# Altium project BP_MotorDriver.PrjPcb
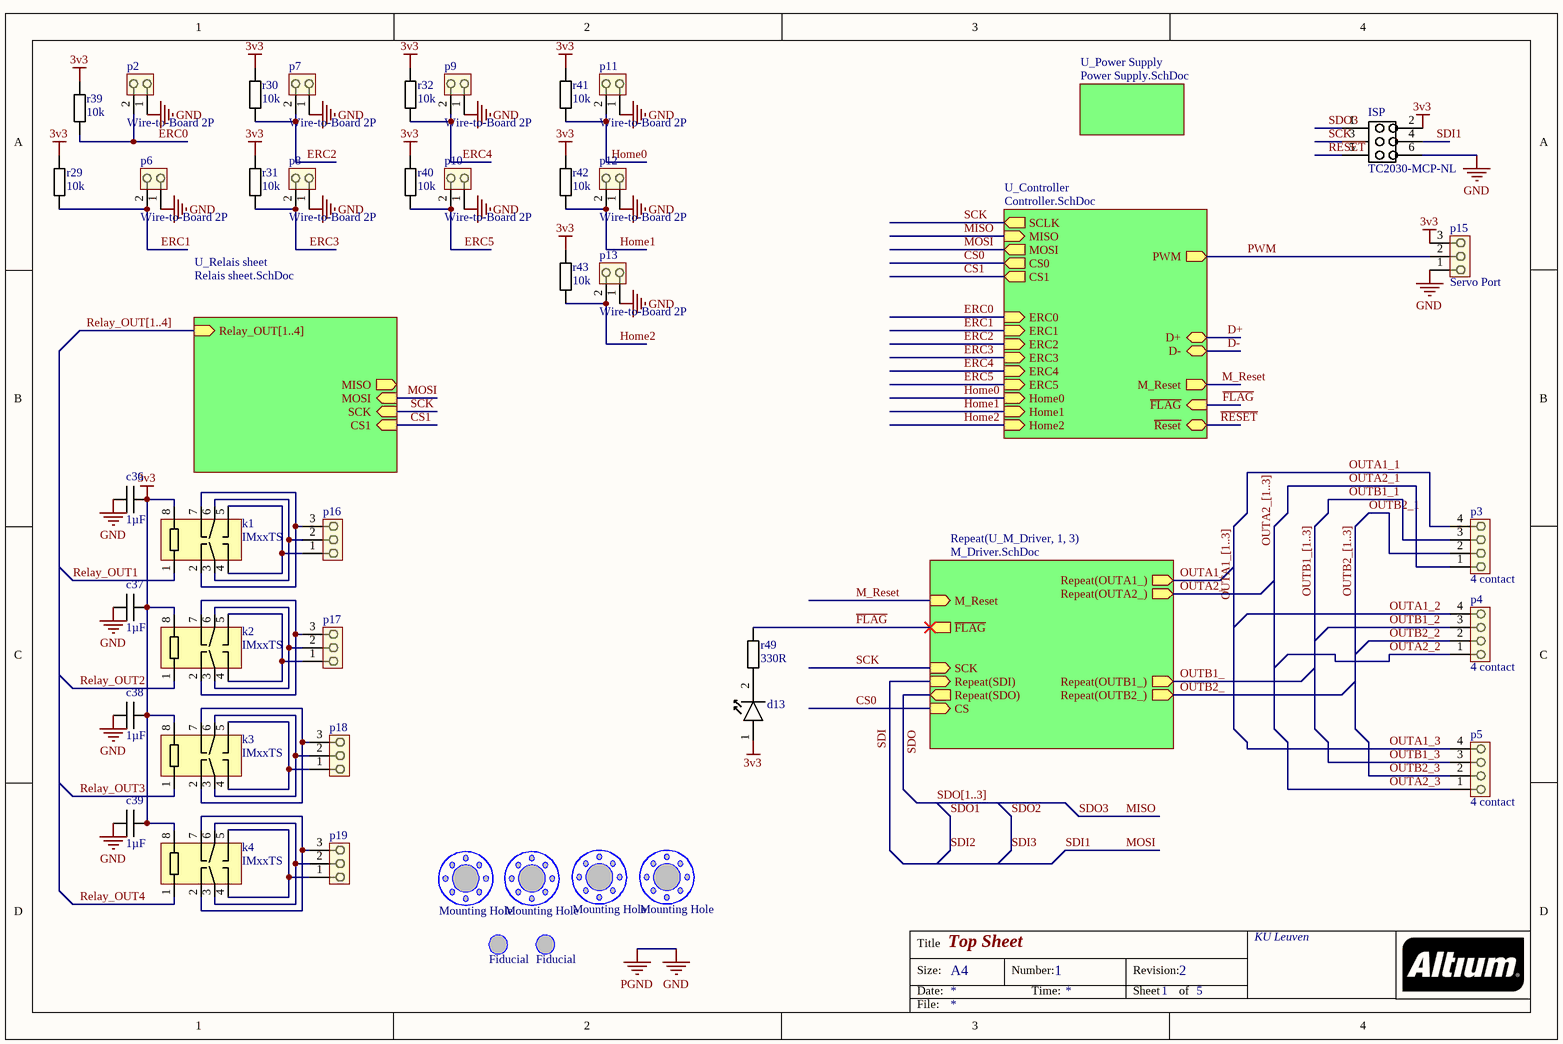
[diagram p0: TOP Sheet.SchDoc]
5 sheets, 213 parts. Net scope: hierarchical (ports join the sheet entries above them; power ports are global).
Board file: MotorDriverV2.PcbDoc
Sheets:
  TOP Sheet.SchDoc
    U_M_Driver1 = M_Driver.SchDoc
    U_M_Driver2 = M_Driver.SchDoc
    U_M_Driver3 = M_Driver.SchDoc
    U_Relais sheet = Relais sheet.SchDoc
    U_Controller = Controller.SchDoc
    U_Power Supply = Power Supply.SchDoc

## Sheet TOP Sheet.SchDoc: Top Sheet
size A4; Date: 14/02/2018; CheckedBy: Mr. Pauwels; Author: Robbie Smedts; DrawnBy: Robbie Smedts; Engineer: Robbie Smedts; Organization: KU Leuven; DocumentNumber: 1; Revision: 2; SheetNumber: 1; SheetTotal: 5; DocumentName: Top Sheet

### Parts
c36  1µF  [0805]
c37  1µF  [0805]
c38  1µF  [0805]
c39  1µF  [0805]
d13  Yellow SMD LED  [0603 - LED]  (value not drawn)
f3  Fiducial  [Fiducial]
f4  Fiducial  [Fiducial]
H1  Mounting Hole  [Mounting Hole]
H2  Mounting Hole  [Mounting Hole]
H3  Mounting Hole  [Mounting Hole]
H4  Mounting Hole  [Mounting Hole]
ISP  TC2030-MCP-NL  [2x3-HeaderPin]
k1  IMxxTS  [THT-8]
k2  IMxxTS  [THT-8]
k3  IMxxTS  [THT-8]
k4  IMxxTS  [THT-8]
p2  Wire-to-Board 2P  [WtB-F-2p_V]
p3  4 contact  [WtB-F-4p]
p4  4 contact  [WtB-F-4p]
p5  4 contact  [WtB-F-4p]
p6  Wire-to-Board 2P  [WtB-F-2p_V]
p7  Wire-to-Board 2P  [WtB-F-2p_V]
p8  Wire-to-Board 2P  [WtB-F-2p_V]
p9  Wire-to-Board 2P  [WtB-F-2p_V]
p10  Wire-to-Board 2P  [WtB-F-2p_V]
p11  Wire-to-Board 2P  [WtB-F-2p_V]
p12  Wire-to-Board 2P  [WtB-F-2p_V]
p13  Wire-to-Board 2P  [WtB-F-2p_V]
p15  Servo Port  [1X3 Headerpin Angled]
p16  Wire-to-Board 3P  [1X3 Headerpin Angled]  (value not drawn)
p17  Wire-to-Board 3P  [1X3 Headerpin Angled]  (value not drawn)
p18  Wire-to-Board 3P  [1X3 Headerpin Angled]  (value not drawn)
p19  Wire-to-Board 3P  [1X3 Headerpin Angled]  (value not drawn)
r29  10k  [0603]
r30  10k  [0603]
r31  10k  [0603]
r32  10k  [0603]
r39  10k  [0603]
r40  10k  [0603]
r41  10k  [0603]
r42  10k  [0603]
r43  10k  [0603]
r49  330R  [0603]

### Sub-sheets
Repeat(U_M_Driver, 1, 3) = M_Driver.SchDoc: Repeat(OUTA1_) (out), Repeat(OUTA2_) (out), Repeat(OUTB1_) (out), Repeat(OUTB2_) (out), Repeat(SDO) (out), Repeat(SDI) (in), SCK (in), CS (in), ~{FLAG} (out), M_Reset (in)
U_Controller = Controller.SchDoc: MOSI (out), MISO (in), SCLK (out), CS0 (out), CS1 (out), ERC0 (in), ERC1 (in), ERC2 (in), ERC3 (in), ERC4 (in), ERC5 (in), Home0 (in), Home1 (in), Home2 (in), ~{FLAG} (in), PWM (out), ~{Reset} (bidir), D+ (bidir), D- (bidir), M_Reset (out)
U_Power Supply = Power Supply.SchDoc: no entries
U_Relais sheet = Relais sheet.SchDoc: CS1 (in), MOSI (in), MISO (out), SCK (in), Relay_OUT[1..4] (in)

### Nets
3V3: c36.2 c37.2 c38.2 c39.2 d13.1(Anode) ISP.2 k1.8 k2.8 k3.8 k4.8 p15.3 r29.2 r30.2 r31.2 r32.2 r39.2 r40.2 r41.2 r42.2 r43.2
GND: c36.1 c37.1 c38.1 c39.1 ISP.6 p2.1 p6.1 p7.1 p8.1 p9.1 p10.1 p11.1 p12.1 p13.1 p15.1  [also labelled PGND]
CS0: sheet Repeat(U_M_Driver, 1, 3)/CS, sheet U_Controller/CS0
CS1: sheet U_Relais sheet/CS1, sheet U_Controller/CS1
D+: sheet U_Controller/D+
D-: sheet U_Controller/D-
ERC0: p2.2 r39.1 ; sheet U_Controller/ERC0
ERC1: p6.2 r29.1 ; sheet U_Controller/ERC1
ERC2: p7.2 r30.1 ; sheet U_Controller/ERC2
ERC3: p8.2 r31.1 ; sheet U_Controller/ERC3
ERC4: p9.2 r32.1 ; sheet U_Controller/ERC4
ERC5: p10.2 r40.1 ; sheet U_Controller/ERC5
~{FLAG}: r49.2 ; sheet Repeat(U_M_Driver, 1, 3)/~{FLAG}, sheet U_Controller/~{FLAG}
Home0: p11.2 r41.1 ; sheet U_Controller/Home0
Home1: p12.2 r42.1 ; sheet U_Controller/Home1
Home2: p13.2 r43.1 ; sheet U_Controller/Home2
M_Reset: sheet Repeat(U_M_Driver, 1, 3)/M_Reset, sheet U_Controller/M_Reset
MISO: ISP.1 ; sheet U_Controller/MISO  [also labelled SDO3]
MOSI: ISP.4 ; sheet U_Relais sheet/MOSI, sheet U_Controller/MOSI  [also labelled SDI1]
OUTA1_: sheet Repeat(U_M_Driver, 1, 3)/Repeat(OUTA1_)
OUTA1_1: p3.4  [project net OUTA1]
OUTA1_2: p4.4  [project net OUTA1]
OUTA1_3: p5.4  [project net OUTA1]
OUTA2_: sheet Repeat(U_M_Driver, 1, 3)/Repeat(OUTA2_)
OUTA2_1: p3.1  [project net OUTA2]
OUTA2_2: p4.1  [project net OUTA2]
OUTA2_3: p5.1  [project net OUTA2]
OUTB1_: sheet Repeat(U_M_Driver, 1, 3)/Repeat(OUTB1_)
OUTB1_1: p3.3  [project net OUTB1]
OUTB1_2: p4.3  [project net OUTB1]
OUTB1_3: p5.3  [project net OUTB1]
OUTB2_: sheet Repeat(U_M_Driver, 1, 3)/Repeat(OUTB2_)
OUTB2_1: p3.2  [project net OUTB2]
OUTB2_2: p4.2  [project net OUTB2]
OUTB2_3: p5.2  [project net OUTB2]
PWM: p15.2 ; sheet U_Controller/PWM
~{RESET}: ISP.5 ; sheet U_Controller/~{Reset}
Relay_OUT1: k1.1
Relay_OUT2: k2.1
Relay_OUT3: k3.1
Relay_OUT4: k4.1
SCK: ISP.3 ; sheet Repeat(U_M_Driver, 1, 3)/SCK, sheet U_Relais sheet/SCK, sheet U_Controller/SCLK
SDI: sheet Repeat(U_M_Driver, 1, 3)/Repeat(SDI)
SDO: sheet Repeat(U_M_Driver, 1, 3)/Repeat(SDO)
Netd13_2: d13.2(Kathode) r49.1
Netk1_2: k1.2 k1.7 p16.3
Netk1_3: k1.3 k1.6 p16.2
Netk1_4: k1.4 k1.5 p16.1
Netk2_2: k2.2 k2.7 p17.3
Netk2_3: k2.3 k2.6 p17.2
Netk2_4: k2.4 k2.5 p17.1
Netk3_2: k3.2 k3.7 p18.3
Netk3_3: k3.3 k3.6 p18.2
Netk3_4: k3.4 k3.5 p18.1
Netk4_2: k4.2 k4.7 p19.3
Netk4_3: k4.3 k4.6 p19.2
Netk4_4: k4.4 k4.5 p19.1

### Buses and harness runs
bus OUTA1_[1..3]
bus OUTA2_[1..3]
bus OUTB1_[1..3]
bus OUTB2_[1..3]
bus Relay_OUT[1..4] = sheet U_Relais sheet/Relay_OUT[1..4]
bus SDO[1..3]

### Notes on the sheet
- Title
- Size:
- Date:
- A4
- Number:
- Time:
- Revision:
- Sheet
- of
- File:

### Library data of the parts
c36-c39 = 0805 Capacitor: ...F
d13 = Yellow SMD LED: 0603 Package
ISP = 2x3 Header: Header Pin
k1-k4 = IMxxTS: Standard THT Package
p3-p5 = Wire-to-Board connector 4 contacts: Wire-to-Board connector
p15 = Wire-to-Board 3 Pin
r29-r32 r39-r43 r49 = 0603 Resistor: ...R

## Sheet M_Driver.SchDoc: M_Driver
size A4; Date: 12/02/2018; CheckedBy: Mr. Pauwels; Author: Robbie Smedts; CompanyName: KU Leuven; DrawnBy: Robbie Smedts; Engineer: Robbie Smedts & Vincent Agemans; Organization: KU Leuven; DocumentNumber: 4; Revision: 2; SheetNumber: 4; SheetTotal: 5; DocumentName: M_Driver
Used 3 times, as channels U_M_Driver1, U_M_Driver2, U_M_Driver3. Parts and nets are listed once, with the designators drawn on the sheet.
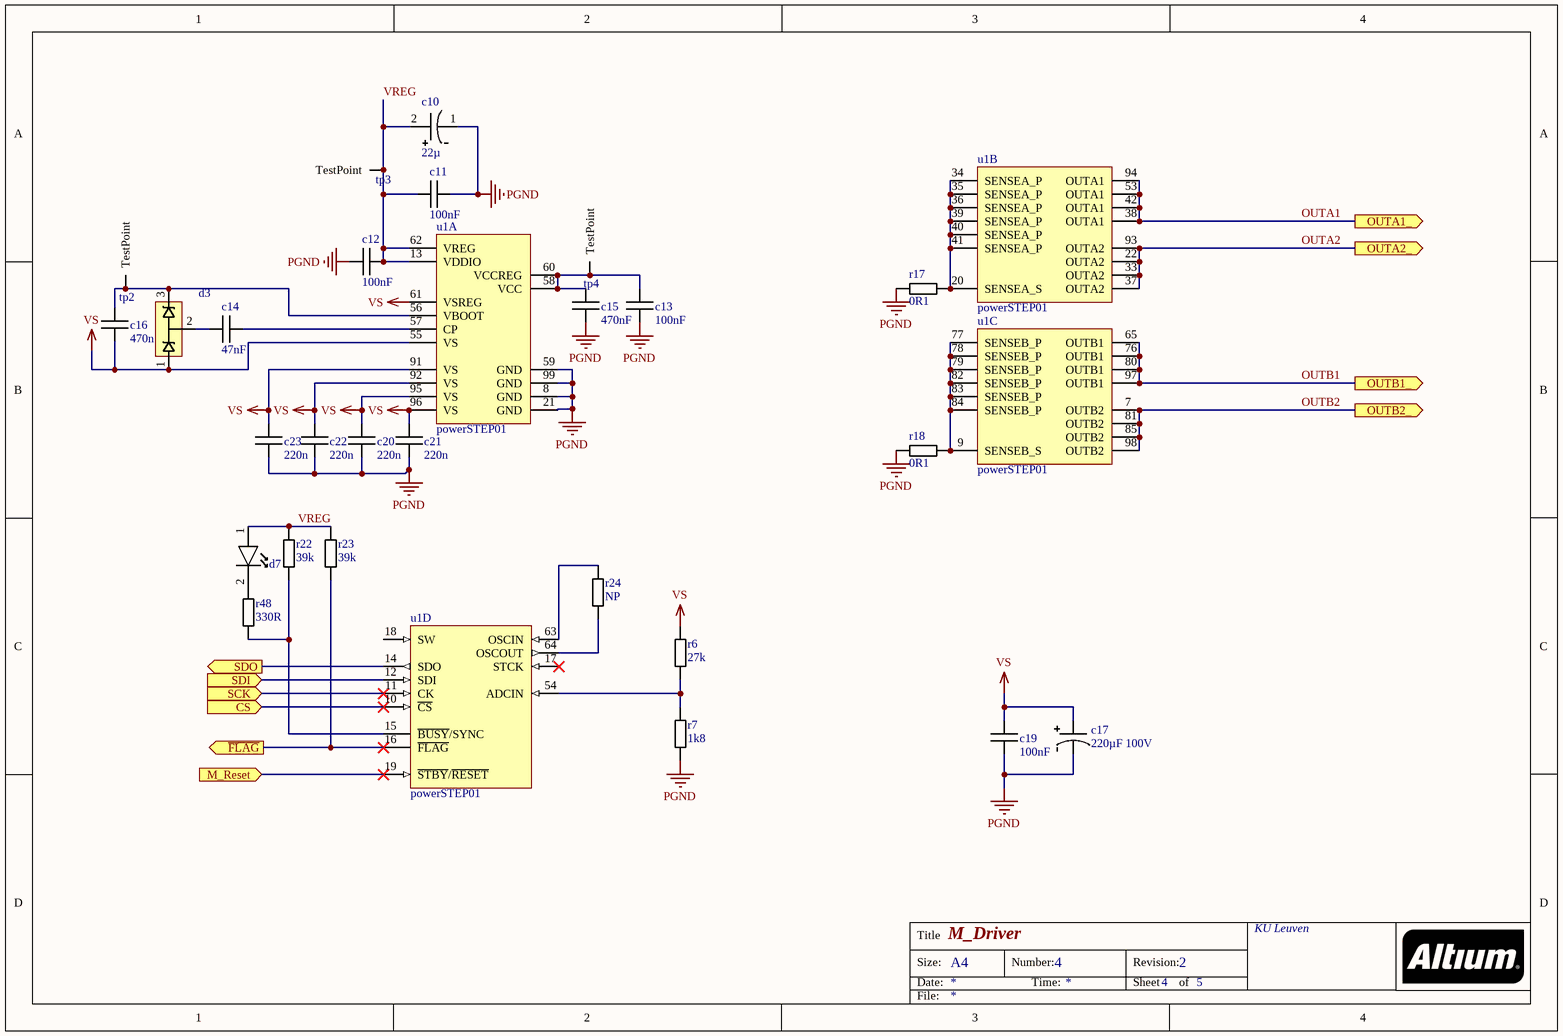
[diagram p1: M_Driver.SchDoc]

### Parts
c10  22µ  [Elco-B]
c11  100nF  [0805]
c12  100nF  [0805]
c13  100nF  [0805]
c14  47nF  [0805]
c15  470nF  [0805]
c16  470n  [0805]
c17  220µF 100V  [TH Elco 12.5]
c19  100nF  [0805]
c20  220n  [0805]
c21  220n  [0805]
c22  220n  [0805]
c23  220n  [0805]
d3  BAS40-04  [SOT23]  (value not drawn)
d7  Yellow SMD LED  [0603 - LED]  (value not drawn)
r6  27k  [0805]
r7  1k8  [0805]
r17  0R1  [2512]
r18  0R1  [2512]
r22  39k  [0805]
r23  39k  [0805]
r24  NP  [0603]
r48  330R  [0603]
tp2  Test Point  [Test Point]  (value not drawn)
tp3  Test Point  [Test Point]  (value not drawn)
tp4  Test Point  [Test Point]  (value not drawn)
u1  powerSTEP01  [VFQFPN]  (parts A,B,C,D of 4)

### Ports
CS (in), M_Reset (in), OUTA1_ (out), OUTA2_ (out), OUTB1_ (out), OUTB2_ (out), SCK (in), SDI (in), SDO (out), ~{FLAG} (out)

### Nets
PGND: c10.1 c11.1 c12.2 c13.1 c15.1 c17.1 c19.1 c20.2 c21.2 c22.2 c23.2 r7.1 r17.1 r18.1 u1.8(GND) u1.21(GND) u1.59(GND) u1.99(GND)
VS: c16.2 c17.2 c19.2 c20.1 c21.1 c22.1 c23.1 d3.1 r6.2 u1.55(VS) u1.61(VSREG) u1.91(VS) u1.92(VS) u1.95(VS) u1.96(VS)
CS: u1.10(~{CS}) ; port CS
~{FLAG}: r23.2 u1.16(~{FLAG}) ; port ~{FLAG}
M_Reset: u1.19(~{STBY}/~{RESET}) ; port M_Reset
OUTA1: u1.38(OUTA1) u1.42(OUTA1) u1.53(OUTA1) u1.94(OUTA1) ; port OUTA1_
OUTA2: u1.22(OUTA2) u1.33(OUTA2) u1.37(OUTA2) u1.93(OUTA2) ; port OUTA2_
OUTB1: u1.65(OUTB1) u1.76(OUTB1) u1.80(OUTB1) u1.97(OUTB1) ; port OUTB1_
OUTB2: u1.7(OUTB2) u1.81(OUTB2) u1.85(OUTB2) u1.98(OUTB2) ; port OUTB2_
SCK: u1.11(CK) ; port SCK
SDI: u1.12(SDI) ; port SDI
SDO: u1.14(SDO) ; port SDO
VREG: c10.2 c11.2 c12.1 d7.1(Anode) r22.1 r23.1 tp3.1(TestPoint) u1.13(VDDIO) u1.62(VREG)
Netc13_2: c13.2 c15.2 tp4.1(TestPoint) u1.58(VCC) u1.60(VCCREG)
Netc14_1: c14.1 d3.2
Netc14_2: c14.2 u1.57(CP)
Netc16_1: c16.1 d3.3 tp2.1(TestPoint) u1.56(VBOOT)
Netd7_2: d7.2(Kathode) r48.2
Netr6_1: r6.1 r7.2 u1.54(ADCIN)
Netr17_2: r17.2 u1.20(SENSEA_S) u1.34(SENSEA_P) u1.35(SENSEA_P) u1.36(SENSEA_P) u1.39(SENSEA_P) u1.40(SENSEA_P) u1.41(SENSEA_P)
Netr18_2: r18.2 u1.9(SENSEB_S) u1.77(SENSEB_P) u1.78(SENSEB_P) u1.79(SENSEB_P) u1.82(SENSEB_P) u1.83(SENSEB_P) u1.84(SENSEB_P)
Netr22_2: r22.2 r48.1 u1.15(~{BUSY}/SYNC)
Netr24_1: r24.1 u1.64(OSCOUT)
Netr24_2: r24.2 u1.63(OSCIN)

Not connected (* = marked no-connect by the designer): u1 17(STCK)* 18(SW)

### Channels
U_M_Driver1: designators end in _U_M_Driver1; ports CS=CS0 M_Reset=M_Reset OUTA1_=OUTA1 OUTA2_=OUTA2 OUTB1_=OUTB1 OUTB2_=OUTB2 SCK=SCK SDI=MOSI SDO=SDI2 ~{FLAG}=~{FLAG}
U_M_Driver2: designators end in _U_M_Driver2; ports CS=CS0 M_Reset=M_Reset OUTA1_=OUTA1 OUTA2_=OUTA2 OUTB1_=OUTB1 OUTB2_=OUTB2 SCK=SCK SDI=SDI2 SDO=SDI3 ~{FLAG}=~{FLAG}
U_M_Driver3: designators end in _U_M_Driver3; ports CS=CS0 M_Reset=M_Reset OUTA1_=OUTA1 OUTA2_=OUTA2 OUTB1_=OUTB1 OUTB2_=OUTB2 SCK=SCK SDI=SDI3 SDO=MISO ~{FLAG}=~{FLAG}

### Notes on the sheet
- Title
- Size:
- Date:
- A4
- Number:
- Time:
- Revision:
- Sheet
- of
- File:

### Library data of the parts
c10 = Elco B
c11-c16 c19-c23 = 0805 Capacitor: ...F
c17 = Elco TH d12.5: d = 12.5mm
d7 = Yellow SMD LED: 0603 Package
r6 r7 r22 r23 = 0805 Resistor: ...R
r17 r18 = 2512 Resistor: ..R
r24 r48 = 0603 Resistor: ...R
u1 = powerSTEP01: VFQFPN

## Sheet Relais sheet.SchDoc: Relay Sheet
size A4; Date: 15/02/2018; CheckedBy: Mr. Pauwels; Author: Robbie Smedts; CompanyName: KU Leuven; DrawnBy: Robbie Smedts; Engineer: Robbie Smedts & Vincent Agemans; Organization: Thomas More; DocumentNumber: 3; Revision: 2; SheetNumber: 3; SheetTotal: 5
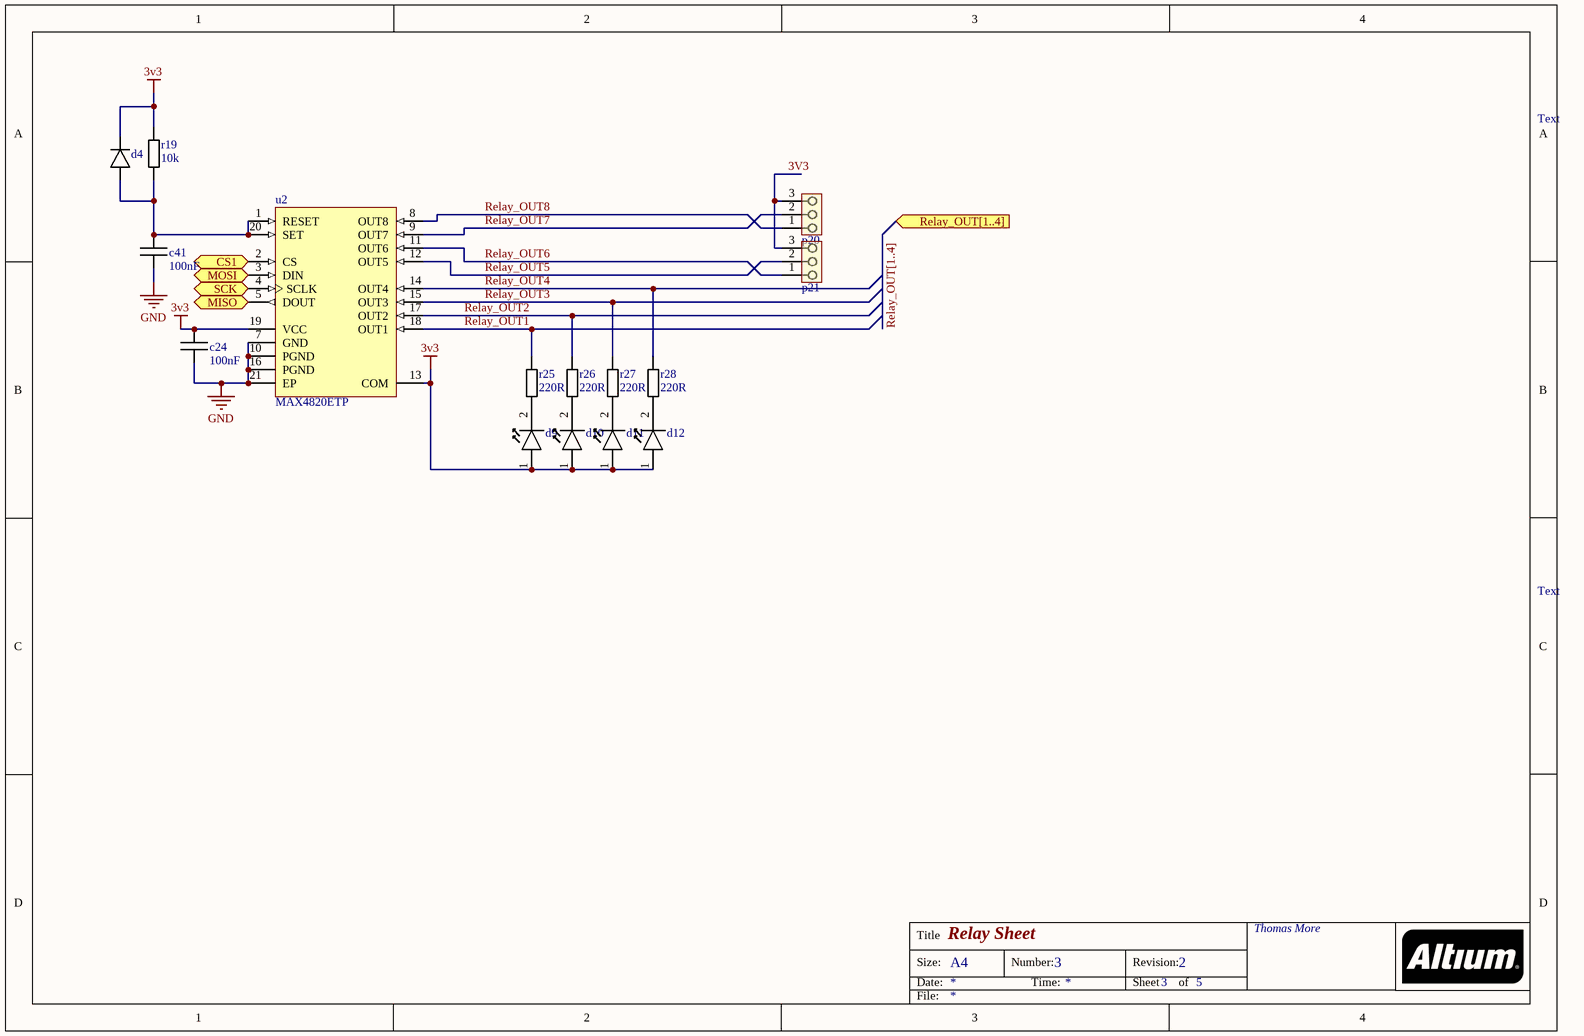
[diagram p2: Relais sheet.SchDoc]

### Parts
c24  100nF  [0805]
c41  100nF  [0603]
d4  CD1206-S01575  [1206 - DIODE]  (value not drawn)
d9  Yellow SMD LED  [0603 - LED]  (value not drawn)
d10  Yellow SMD LED  [0603 - LED]  (value not drawn)
d11  Yellow SMD LED  [0603 - LED]  (value not drawn)
d12  Yellow SMD LED  [0603 - LED]  (value not drawn)
p20  Wire-to-Board 3P  [1X3 Headerpin Angled]  (value not drawn)
p21  Wire-to-Board 3P  [1X3 Headerpin Angled]  (value not drawn)
r19  10k  [0603]
r25  220R  [0603]
r26  220R  [0603]
r27  220R  [0603]
r28  220R  [0603]
u2  MAX4820ETP  [TQFN-20]

### Ports
CS1 (in), MISO (out), MOSI (in), Relay_OUT[1..4] (in), SCK (in)

### Nets
3V3: c24.1 d4.1(Kathode) d9.1(Anode) d10.1(Anode) d11.1(Anode) d12.1(Anode) p20.3 p21.3 r19.2 u2.13(COM) u2.19(VCC)
GND: c24.2 c41.1 u2.0(EP) u2.7(GND) u2.10(PGND) u2.16(PGND) u2.21(EP)
CS1: u2.2(CS) ; port CS1
MOSI: u2.3(DIN) ; port MOSI
Relay_OUT1: r25.2 u2.18(OUT1)
Relay_OUT2: r26.2 u2.17(OUT2)
Relay_OUT3: r27.2 u2.15(OUT3)
Relay_OUT4: r28.2 u2.14(OUT4)
Relay_OUT5: p21.2 u2.12(OUT5)
Relay_OUT6: p21.1 u2.11(OUT6)
Relay_OUT7: p20.2 u2.9(OUT7)
Relay_OUT8: p20.1 u2.8(OUT8)
SCK: u2.4(SCLK) ; port SCK
Netc41_2: c41.2 d4.2(Anode) r19.1 u2.1(RESET) u2.20(SET)
Netd9_2: d9.2(Kathode) r25.1
Netd10_2: d10.2(Kathode) r26.1
Netd11_2: d11.2(Kathode) r27.1
Netd12_2: d12.2(Kathode) r28.1
Netu2_5: u2.5(DOUT) ; port MISO

### Buses and harness runs
bus Relay_OUT[1..4] = port Relay_OUT[1..4]

### Notes on the sheet
- Text
- Title
- Size:
- Date:
- A4
- Number:
- Time:
- Revision:
- Sheet
- of
- File:

### Library data of the parts
c24 = 0805 Capacitor: ...F
c41 = 0603 Capacitor: ...F
d4 = CD1206-S01575: Switching Chip Diode
d9-d12 = Yellow SMD LED: 0603 Package
r19 r25-r28 = 0603 Resistor: ...R
u2 = MAX4820ETP: 20 TQFN-EP

## Sheet Controller.SchDoc: Controller schematic
size A4; Date: 2018-02-12; CheckedBy: Mr. Pauwels; Author: Robbie Smedts; CompanyName: Thomas More; DrawnBy: Robbie Smedts; Engineer: Robbie Smedts & Vincent Agemans; Organization: KULeuven; DocumentNumber: 2; Revision: 2; SheetNumber: 2; SheetTotal: 5; DocumentName: Controller Schematic; ProjectName: Stepper driver
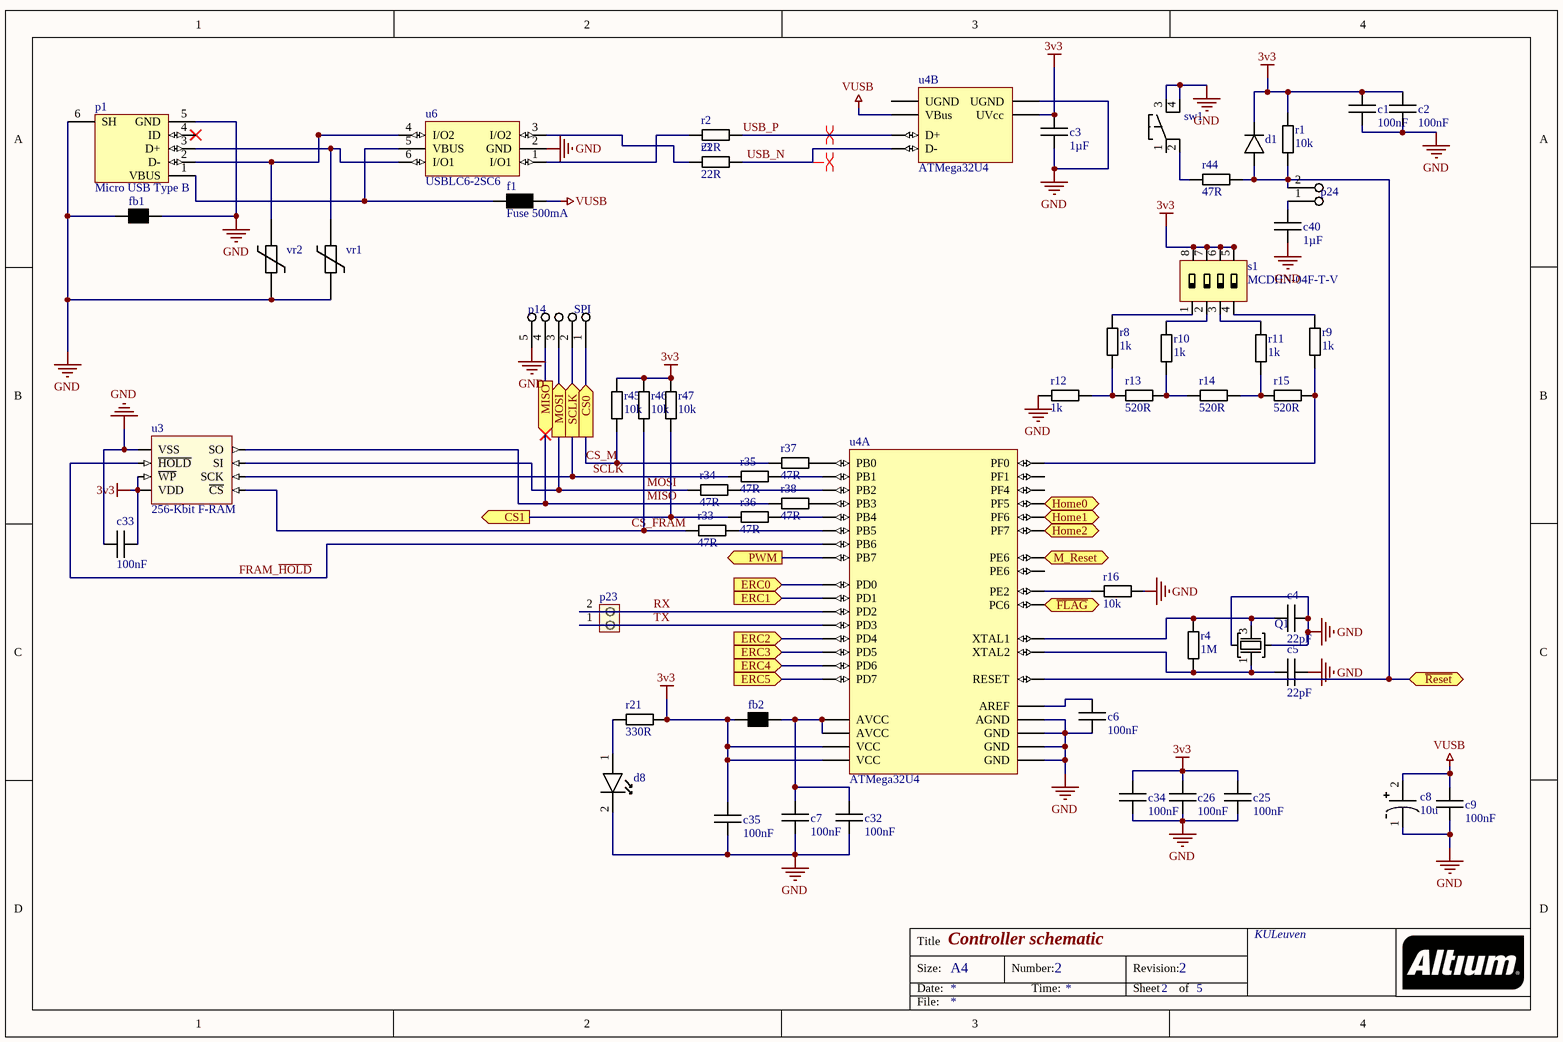
[diagram p3: Controller.SchDoc]

### Parts
c1  100nF  [0603]
c2  100nF  [0603]
c3  1µF  [0603]
c4  22pF  [0603]
c5  22pF  [0603]
c6  100nF  [0603]
c7  100nF  [0603]
c8  10u  [Elco-C]
c9  100nF  [0603]
c25  100nF  [0603]
c26  100nF  [0603]
c32  100nF  [0603]
c33  100nF  [0603]
c34  100nF  [0603]
c35  100nF  [0603]
c40  1µF  [0603]
d1  CD1206-S01575  [1206 - DIODE]  (value not drawn)
d8  Green SMD LED  [0603 - LED]  (value not drawn)
f1  Fuse 500mA  [PTC Fuses]
fb1  0603 Ferrite Bead  [0603]  (value not drawn)
fb2  0603 Ferrite Bead  [0603]  (value not drawn)
p1  Micro USB Type B  [Micro USB Type B]
p14  SPI  [1x5-HeaderPin]
p23  Wire-to-Board 2P  [WtB-F-2p]  (value not drawn)
p24  2 Pin Header  [1x2-HeaderPin]  (value not drawn)
Q1  Crystal 16MHz, 3.2x2.5mm  [X32]  (value not drawn)
r1  10k  [0603]
r2  22R  [0603]
r3  22R  [0603]
r4  1M  [0603]
r8  1k  [0603]
r9  1k  [0603]
r10  1k  [0603]
r11  1k  [0603]
r12  1k  [0603]
r13  520R  [0603]
r14  520R  [0603]
r15  520R  [0603]
r16  10k  [0603]
r21  330R  [0603]
r33  47R  [0603]
r34  47R  [0603]
r35  47R  [0603]
r36  47R  [0603]
r37  47R  [0603]
r38  47R  [0603]
r44  47R  [0603]
r45  10k  [0603]
r46  10k  [0603]
r47  10k  [0603]
s1  MCDHN-04F-T-V  [Dipswitch-4]
sw1  MCDTSJW-6  [MCDTSJW6]  (value not drawn)
u3  256-Kbit F-RAM  [SOIC8N]
u4  ATMega32U4  [TQFP-44]  (parts A,B of 2)
u6  USBLC6-2SC6  [SOT23-6]
vr1  CG0603MLC-05E  [0603]  (value not drawn)
vr2  CG0603MLC-05E  [0603]  (value not drawn)

### Ports
CS0 (out), CS1 (out), ERC0 (in), ERC1 (in), ERC2 (in), ERC3 (in), ERC4 (in), ERC5 (in), Home0 (in), Home1 (in), Home2 (in), M_Reset (out), MISO (in), MOSI (out), PWM (out), SCLK (out), ~{FLAG} (in), ~{Reset} (bidir)

### Nets
3V3: c1.1 c2.1 c3.1 c25.1 c26.1 c33.2 c34.1 c35.1 d1.1(Kathode) fb2.1 r1.2 r21.2 r45.2 r46.2 r47.2 s1.5 s1.6 s1.7 s1.8 u3.3(~{WP}) u3.8(VDD) u4.2(UVcc) u4.14(VCC) u4.34(VCC)
GND: c1.2 c2.2 c3.2 c4.2 c5.2 c6.1 c7.2 c8.1 c9.2 c25.2 c26.2 c32.2 c33.1 c34.2 c35.2 c40.1 d8.2(Kathode) fb1.1 fb1.2 p1.5(GND) p1.6(SH) p14.5 Q1.2 Q1.4 r12.2 r16.1 sw1.3 sw1.4 u3.4(VSS) u4.5(UGND) u4.15(GND) u4.23(GND) u4.35(GND) u4.43(AGND) u6.2(GND) vr1.1 vr2.1
VUSB: c8.2 c9.1 f1.2 u4.7(VBus)
CS1: r36.1 r47.1 ; port CS1
CS_FRAM: r33.1 r46.1 u3.1(~{CS})
CS_M: p14.1 r37.1 r45.1 ; port CS0  [project net CS0]
ERC0: u4.18(PD0) ; port ERC0
ERC1: u4.19(PD1) ; port ERC1
ERC2: u4.25(PD4) ; port ERC2
ERC3: u4.22(PD5) ; port ERC3
ERC4: u4.26(PD6) ; port ERC4
ERC5: u4.27(PD7) ; port ERC5
~{FLAG}: u4.31(PC6) ; port ~{FLAG}
FRAM_~{HOLD}: u3.7(~{HOLD}) u4.30(PB6)
Home0: u4.38(PF5) ; port Home0
Home1: u4.37(PF6) ; port Home1
Home2: u4.36(PF7) ; port Home2
M_Reset: u4.1(PE6) ; port M_Reset
MISO: p14.4 r38.1 u3.2(SO) ; port MISO
MOSI: p14.3 r34.1 u3.5(SI) ; port MOSI
PWM: u4.12(PB7) ; port PWM
~{RESET}: d1.2(Anode) p24.2 r1.1 r44.2 u4.13(RESET) ; port ~{Reset}
RX: p23.2 u4.20(PD2)
SCLK: p14.2 r35.1 u3.6(SCK) ; port SCLK  [project net SCK]
TX: p23.1 u4.21(PD3)
USB_N: r3.2 u4.3(D-)
USB_P: r2.2 u4.4(D+)
Netc4_1: c4.1 Q1.3 r4.1 u4.17(XTAL1)
Netc5_1: c5.1 Q1.1 r4.2 u4.16(XTAL2)
Netc6_2: c6.2 u4.42(AREF)
Netc7_1: c7.1 c32.1 fb2.2 u4.24(AVCC) u4.44(AVCC)
Netc40_2: c40.2 p24.1
Netd8_1: d8.1(Anode) r21.1
Netf1_1: f1.1 p1.1(VBUS) u6.5(VBUS)
Netp1_2: p1.2(D-) u6.4(I/O2) vr2.2
Netp1_3: p1.3(D+) u6.6(I/O1) vr1.2
Netr2_1: r2.1 u6.1(I/O1)
Netr3_1: r3.1 u6.3(I/O2)
Netr8_1: r8.1 r12.1 r13.2
Netr8_2: r8.2 s1.1
Netr9_1: r9.1 r15.1 u4.41(PF0)
Netr9_2: r9.2 s1.4
Netr10_1: r10.1 r13.1 r14.2
Netr10_2: r10.2 s1.2
Netr11_1: r11.1 r14.1 r15.2
Netr11_2: r11.2 s1.3
Netr16_2: r16.2 u4.33(PE2)
Netr33_2: r33.2 u4.29(PB5)
Netr34_2: r34.2 u4.10(PB2)
Netr35_2: r35.2 u4.9(PB1)
Netr36_2: r36.2 u4.28(PB4)
Netr37_2: r37.2 u4.8(PB0)
Netr38_2: r38.2 u4.11(PB3)
Netr44_1: r44.1 sw1.2

Not connected (* = marked no-connect by the designer): p1 4(ID)*; sw1 1; u4 39(PF4) 40(PF1)

### Layout directives
differential pair: USB_N, USB_P

### Notes on the sheet
- Title
- Size:
- Date:
- A4
- Number:
- Time:
- Revision:
- Sheet
- of
- File:

### Library data of the parts
c1-c7 c9 c25 c26 c32-c35 c40 = 0603 Capacitor: ...F
c8 = Elco C
d1 = CD1206-S01575: Switching Chip Diode
d8 = Green SMD LED: 0603 Package
f1 = MF-MSMF Fuse: Style 1
p1 = Micro USB Type B: SMD
p14 = 5 Pin Header
Q1 = Crystal 16MHz, 3.2x2.5mm: X32
r1-r4 r8-r16 r21 r33-r38 r44-r47 = 0603 Resistor: ...R
s1 = MCDHN-04F-T-V: Dipswitch 4 way
sw1 = MCDTSJW-6: Push button
u3 = FM25W256: 256-Kbit (32Kx8) Serial SPI F-RAM
u6 = USBLC6-2SC6: SOT23-6 ESD
vr1 vr2 = CG0603MLC-05E: 5V, 8V Varistor - 0603

## Sheet Power Supply.SchDoc: Power Supply
size A4; Author: Robbie Smedts; DrawnBy: Robbie Smedts; Engineer: Robbie Smedts; Organization: Thomas More; DocumentNumber: 5; Revision: 1; SheetNumber: 5; SheetTotal: 5; DocumentName: Power Supply
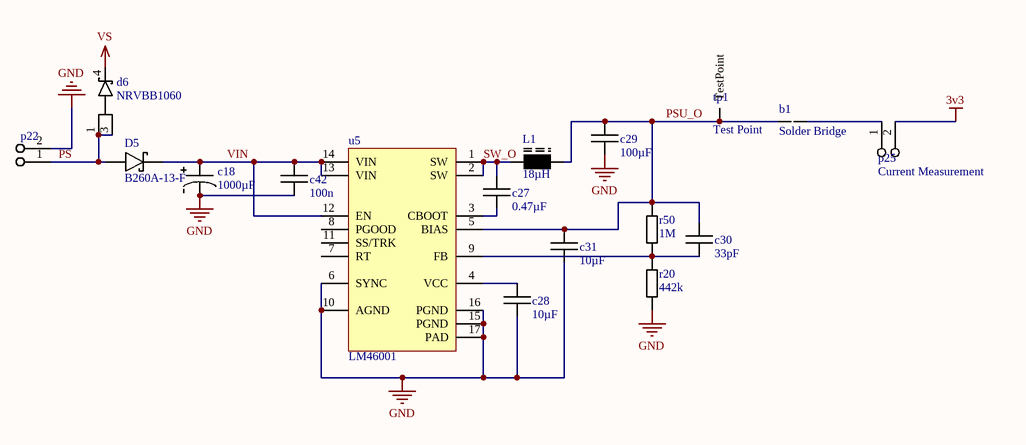
[diagram p4: Power Supply.SchDoc]

### Parts
b1  Solder Bridge  [Solder Bridge]
c18  1000µF  [TH Elco 16]
c27  0.47µF  [0805]
c28  10µF  [0603]
c29  100µF  [1210]
c30  33pF  [0603]
c31  10µF  [0603]
c42  100n  [0603]
D5  B260A-13-F  [DO-214AB (SMA)]
d6  NRVBB1060  [D²PAK 3]
L1  18µH  [SMD Inductor 7.4x7.4]
p22  MKDSN 1.5  [ScrewWtB-2]  (value not drawn)
p25  Current Measurement  [1x2-HeaderPin]
r20  442k  [0603]
r50  1M  [0603]
tp1  Test Point  [Test Point]
u5  LM46001  [PWP0016G]

### Nets
3V3: p25.2
GND: c18.1 c28.1 c29.1 c31.1 c42.1 p22.2 r20.1 u5.6(SYNC) u5.10(AGND) u5.15(PGND) u5.16(PGND) u5.17(PAD)  [also labelled PGND]
SW: u5.2(SW)
VIN: c18.2 c42.2 D5.1(Kathode) u5.12(EN) u5.13(VIN) u5.14(Vin)
VS: d6.4
PS: D5.2(Anode) d6.1 d6.3 p22.1
PSU_O: b1.1 c29.2 c30.2 c31.2 L1.2 r50.1 tp1.1(TestPoint) u5.5(BIAS)
SW_O: c27.2 L1.1 u5.1(SW) u5.2(SW)
Netb1_2: b1.2 p25.1
Netc27_1: c27.1 u5.3(CBOOT)
Netc28_2: c28.2 u5.4(VCC)
Netc30_1: c30.1 r20.2 r50.2 u5.9(FB)

Not connected (* = marked no-connect by the designer): u5 7(RT) 8(PGOOD) 11(SS/TRK)

### Notes on the sheet
- Title
- Size:
- Date:
- A4
- Number:
- Time:
- Revision:
- Sheet
- of
- File:

### Library data of the parts
c18 = Elco TH d16: d = 16mm
c27 = 0805 Capacitor: ...F
c28 c30 c31 c42 = 0603 Capacitor: ...F
c29 = 1210 Capacitor: C1210C107M8PACTU
D5 = B260A-13-F: Schottky Rectifier
d6 = NRVBB1060: Schottky Diode 10A
L1 = SRR0735A-180M: Shielded Power Inducor
p22 = MKDSN 1.5: Wire-to-board connection
p25 = 2 Pin Header
r20 r50 = 0603 Resistor: ...R

## Nets that join several sheets
3V3: TOP Sheet (20 pins), Relais sheet (11 pins), Controller (24 pins), Power Supply (p25.2)
GND: TOP Sheet (15 pins), U_M_Driver1 (18 pins), U_M_Driver2 (18 pins), U_M_Driver3 (18 pins), Relais sheet (7 pins), Controller (37 pins), Power Supply (12 pins)
VS: U_M_Driver1 (15 pins), U_M_Driver2 (15 pins), U_M_Driver3 (15 pins), Power Supply (d6.4)
CS0: U_M_Driver1 (u1_U_M_Driver1.10), U_M_Driver2 (u1_U_M_Driver2.10), U_M_Driver3 (u1_U_M_Driver3.10), Controller (p14.1 r37.1 r45.1)
CS1: Relais sheet (u2.2), Controller (r36.1 r47.1)
ERC0: TOP Sheet (p2.2 r39.1), Controller (u4.18)
ERC1: TOP Sheet (p6.2 r29.1), Controller (u4.19)
ERC2: TOP Sheet (p7.2 r30.1), Controller (u4.25)
ERC3: TOP Sheet (p8.2 r31.1), Controller (u4.22)
ERC4: TOP Sheet (p9.2 r32.1), Controller (u4.26)
ERC5: TOP Sheet (p10.2 r40.1), Controller (u4.27)
~{FLAG}: TOP Sheet (r49.2), U_M_Driver1 (r23_U_M_Driver1.2 u1_U_M_Driver1.16), U_M_Driver2 (r23_U_M_Driver2.2 u1_U_M_Driver2.16), U_M_Driver3 (r23_U_M_Driver3.2 u1_U_M_Driver3.16), Controller (u4.31)
Home0: TOP Sheet (p11.2 r41.1), Controller (u4.38)
Home1: TOP Sheet (p12.2 r42.1), Controller (u4.37)
Home2: TOP Sheet (p13.2 r43.1), Controller (u4.36)
M_Reset: U_M_Driver1 (u1_U_M_Driver1.19), U_M_Driver2 (u1_U_M_Driver2.19), U_M_Driver3 (u1_U_M_Driver3.19), Controller (u4.1)
MISO: TOP Sheet (ISP.1), U_M_Driver3 (u1_U_M_Driver3.14), Controller (p14.4 r38.1 u3.2)
MOSI: TOP Sheet (ISP.4), U_M_Driver1 (u1_U_M_Driver1.12), Relais sheet (u2.3), Controller (p14.3 r34.1 u3.5)
OUTA1: TOP Sheet (p3.4), U_M_Driver1 (u1_U_M_Driver1.38 u1_U_M_Driver1.42 u1_U_M_Driver1.53 u1_U_M_Driver1.94)
OUTA1: TOP Sheet (p4.4), U_M_Driver2 (u1_U_M_Driver2.38 u1_U_M_Driver2.42 u1_U_M_Driver2.53 u1_U_M_Driver2.94)
OUTA1: TOP Sheet (p5.4), U_M_Driver3 (u1_U_M_Driver3.38 u1_U_M_Driver3.42 u1_U_M_Driver3.53 u1_U_M_Driver3.94)
OUTA2: TOP Sheet (p3.1), U_M_Driver1 (u1_U_M_Driver1.22 u1_U_M_Driver1.33 u1_U_M_Driver1.37 u1_U_M_Driver1.93)
OUTA2: TOP Sheet (p4.1), U_M_Driver2 (u1_U_M_Driver2.22 u1_U_M_Driver2.33 u1_U_M_Driver2.37 u1_U_M_Driver2.93)
OUTA2: TOP Sheet (p5.1), U_M_Driver3 (u1_U_M_Driver3.22 u1_U_M_Driver3.33 u1_U_M_Driver3.37 u1_U_M_Driver3.93)
OUTB1: TOP Sheet (p3.3), U_M_Driver1 (u1_U_M_Driver1.65 u1_U_M_Driver1.76 u1_U_M_Driver1.80 u1_U_M_Driver1.97)
OUTB1: TOP Sheet (p4.3), U_M_Driver2 (u1_U_M_Driver2.65 u1_U_M_Driver2.76 u1_U_M_Driver2.80 u1_U_M_Driver2.97)
OUTB1: TOP Sheet (p5.3), U_M_Driver3 (u1_U_M_Driver3.65 u1_U_M_Driver3.76 u1_U_M_Driver3.80 u1_U_M_Driver3.97)
OUTB2: TOP Sheet (p3.2), U_M_Driver1 (u1_U_M_Driver1.7 u1_U_M_Driver1.81 u1_U_M_Driver1.85 u1_U_M_Driver1.98)
OUTB2: TOP Sheet (p4.2), U_M_Driver2 (u1_U_M_Driver2.7 u1_U_M_Driver2.81 u1_U_M_Driver2.85 u1_U_M_Driver2.98)
OUTB2: TOP Sheet (p5.2), U_M_Driver3 (u1_U_M_Driver3.7 u1_U_M_Driver3.81 u1_U_M_Driver3.85 u1_U_M_Driver3.98)
PWM: TOP Sheet (p15.2), Controller (u4.12)
~{RESET}: TOP Sheet (ISP.5), Controller (5 pins)
Relay_OUT1: TOP Sheet (k1.1), Relais sheet (r25.2 u2.18)
Relay_OUT2: TOP Sheet (k2.1), Relais sheet (r26.2 u2.17)
Relay_OUT3: TOP Sheet (k3.1), Relais sheet (r27.2 u2.15)
Relay_OUT4: TOP Sheet (k4.1), Relais sheet (r28.2 u2.14)
SCK: TOP Sheet (ISP.3), U_M_Driver1 (u1_U_M_Driver1.11), U_M_Driver2 (u1_U_M_Driver2.11), U_M_Driver3 (u1_U_M_Driver3.11), Relais sheet (u2.4), Controller (p14.2 r35.1 u3.6)
SDI2: U_M_Driver1 (u1_U_M_Driver1.14), U_M_Driver2 (u1_U_M_Driver2.12)
SDI3: U_M_Driver2 (u1_U_M_Driver2.14), U_M_Driver3 (u1_U_M_Driver3.12)